# Altium schematic sheet REG_CHAV_5V_3A_ST1S40IDR.SchDoc
size A4; SheetNumber: 3; SheetTotal: 8
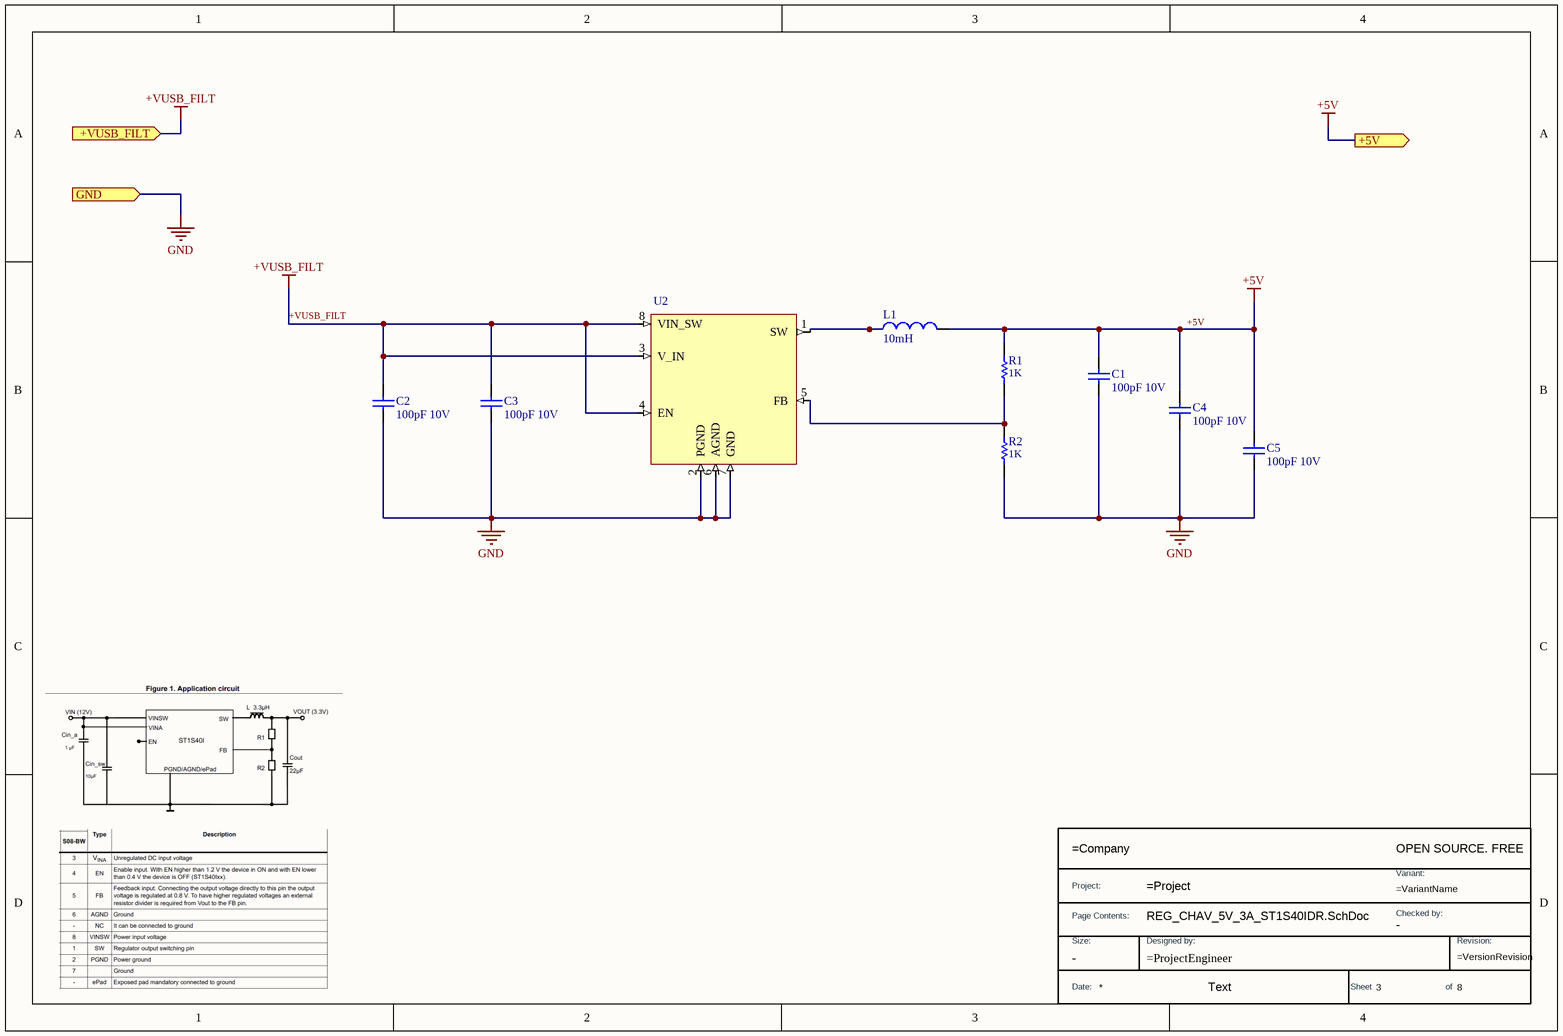
[diagram p0: REG_CHAV_5V_3A_ST1S40IDR.SchDoc]

## Parts
*  TitleBlock  (value not drawn)  (graphical)
C1  value 100pF 10V  (hidden comment: _Capacitor)
C2  value 100pF 10V  (hidden comment: _Capacitor)
C3  value 100pF 10V  (hidden comment: _Capacitor)
C4  value 100pF 10V  (hidden comment: _Capacitor)
C5  value 100pF 10V  (hidden comment: _Capacitor)
L1  value 10mH  (hidden comment: _Inductor)
R1  value 1K  (hidden comment: _Resistor)
R2  value 1K  (hidden comment: _Resistor)
U2  ST1S40IDR  (value not drawn)

## Ports
+5V (out, see 1[4B], 4[1A]), +VUSB_FILT (in, see 1[3B], 2[4A]), GND (in, see 1[3C], 2[4A], 4[1A])

## Nets
+5V: C1.2 C4.2 C5.2 L1.2 R1.2 ; port +5V
+VUSB_FILT: C2.2 C3.2 U2.3(V_IN) U2.4(EN) U2.8(VIN_SW) ; port +VUSB_FILT
GND: C1.1 C2.1 C3.1 C4.1 C5.1 R2.1 U2.2(PGND) U2.6(AGND) U2.7(GND) ; port GND
NetL1_1: L1.1 U2.1(SW)
NetR1_1: R1.1 R2.2 U2.5(FB)

## Notes on the sheet
- Todas as informações e detalhes técnicos deste documento são de inteira propriedade da empresa V2COM,
- não poderão ser copiados, reduzidos ou cedidos a terceiros sem prévia autorização por escrito da mesma.
- Salvo em (D/M/A):
- Página:
- de
- Nome do Projeto:
- https://v2com.com/
- Ed.:
- Responsável:
- Nome da página:
- Rev.:
- Projetista:
- Obs.:
- Revisor:
- Arquivo:
- -
- (in symbol TitleBlock) OPEN SOURCE. FREE; Project:; Variant:; Page Contents:; Checked by:; Size:; Designed by:; Revision:; Date:; Text; Sheet; of

## Library data of the parts
* = TitleBlock: Standard Title Block; DWG NO: =ProjectEngineer; Size: -; Checked by: -
C1-C5 = _Capacitor: Capacitor; Published: 8-Jun-2000; LatestRevisionDate: 17-Jul-2002; LatestRevisionNote: Re-released for DXP Platform.; PackageReference: RAD-0.3; Publisher: Altium Limited; PackageDescription: Radial Cap, Thru-Hole; 2 Leads; 0.3 in Pin Spacing
L1 = _Inductor: Inductor; Code_IEC: 1005; Published: 8-Jun-2000; LatestRevisionDate: 29-May-2009; LatestRevisionNote: IPC-7351 Footprint Added.; PackageReference: 0402-A; Publisher: Altium Limited; PackageDescription: Chip Inductor; Code_JEITA: 0402
R1 R2 = _Resistor: Resistor; Published: 8-Jun-2000; LatestRevisionDate: 17-Jul-2002; LatestRevisionNote: Re-released for DXP Platform.; PackageReference: AXIAL-0.3; Publisher: Altium Limited; PackageDescription: Axial Device, Thru-Hole; 2 Leads; 0.3 in Pin Spacing
U2 = ST1S40IDR: IC REG BUCK ADJUSTABLE 3A 8SO